# EAGLE design riffleito-KAP-REVB (EAGLE 6.5.0)
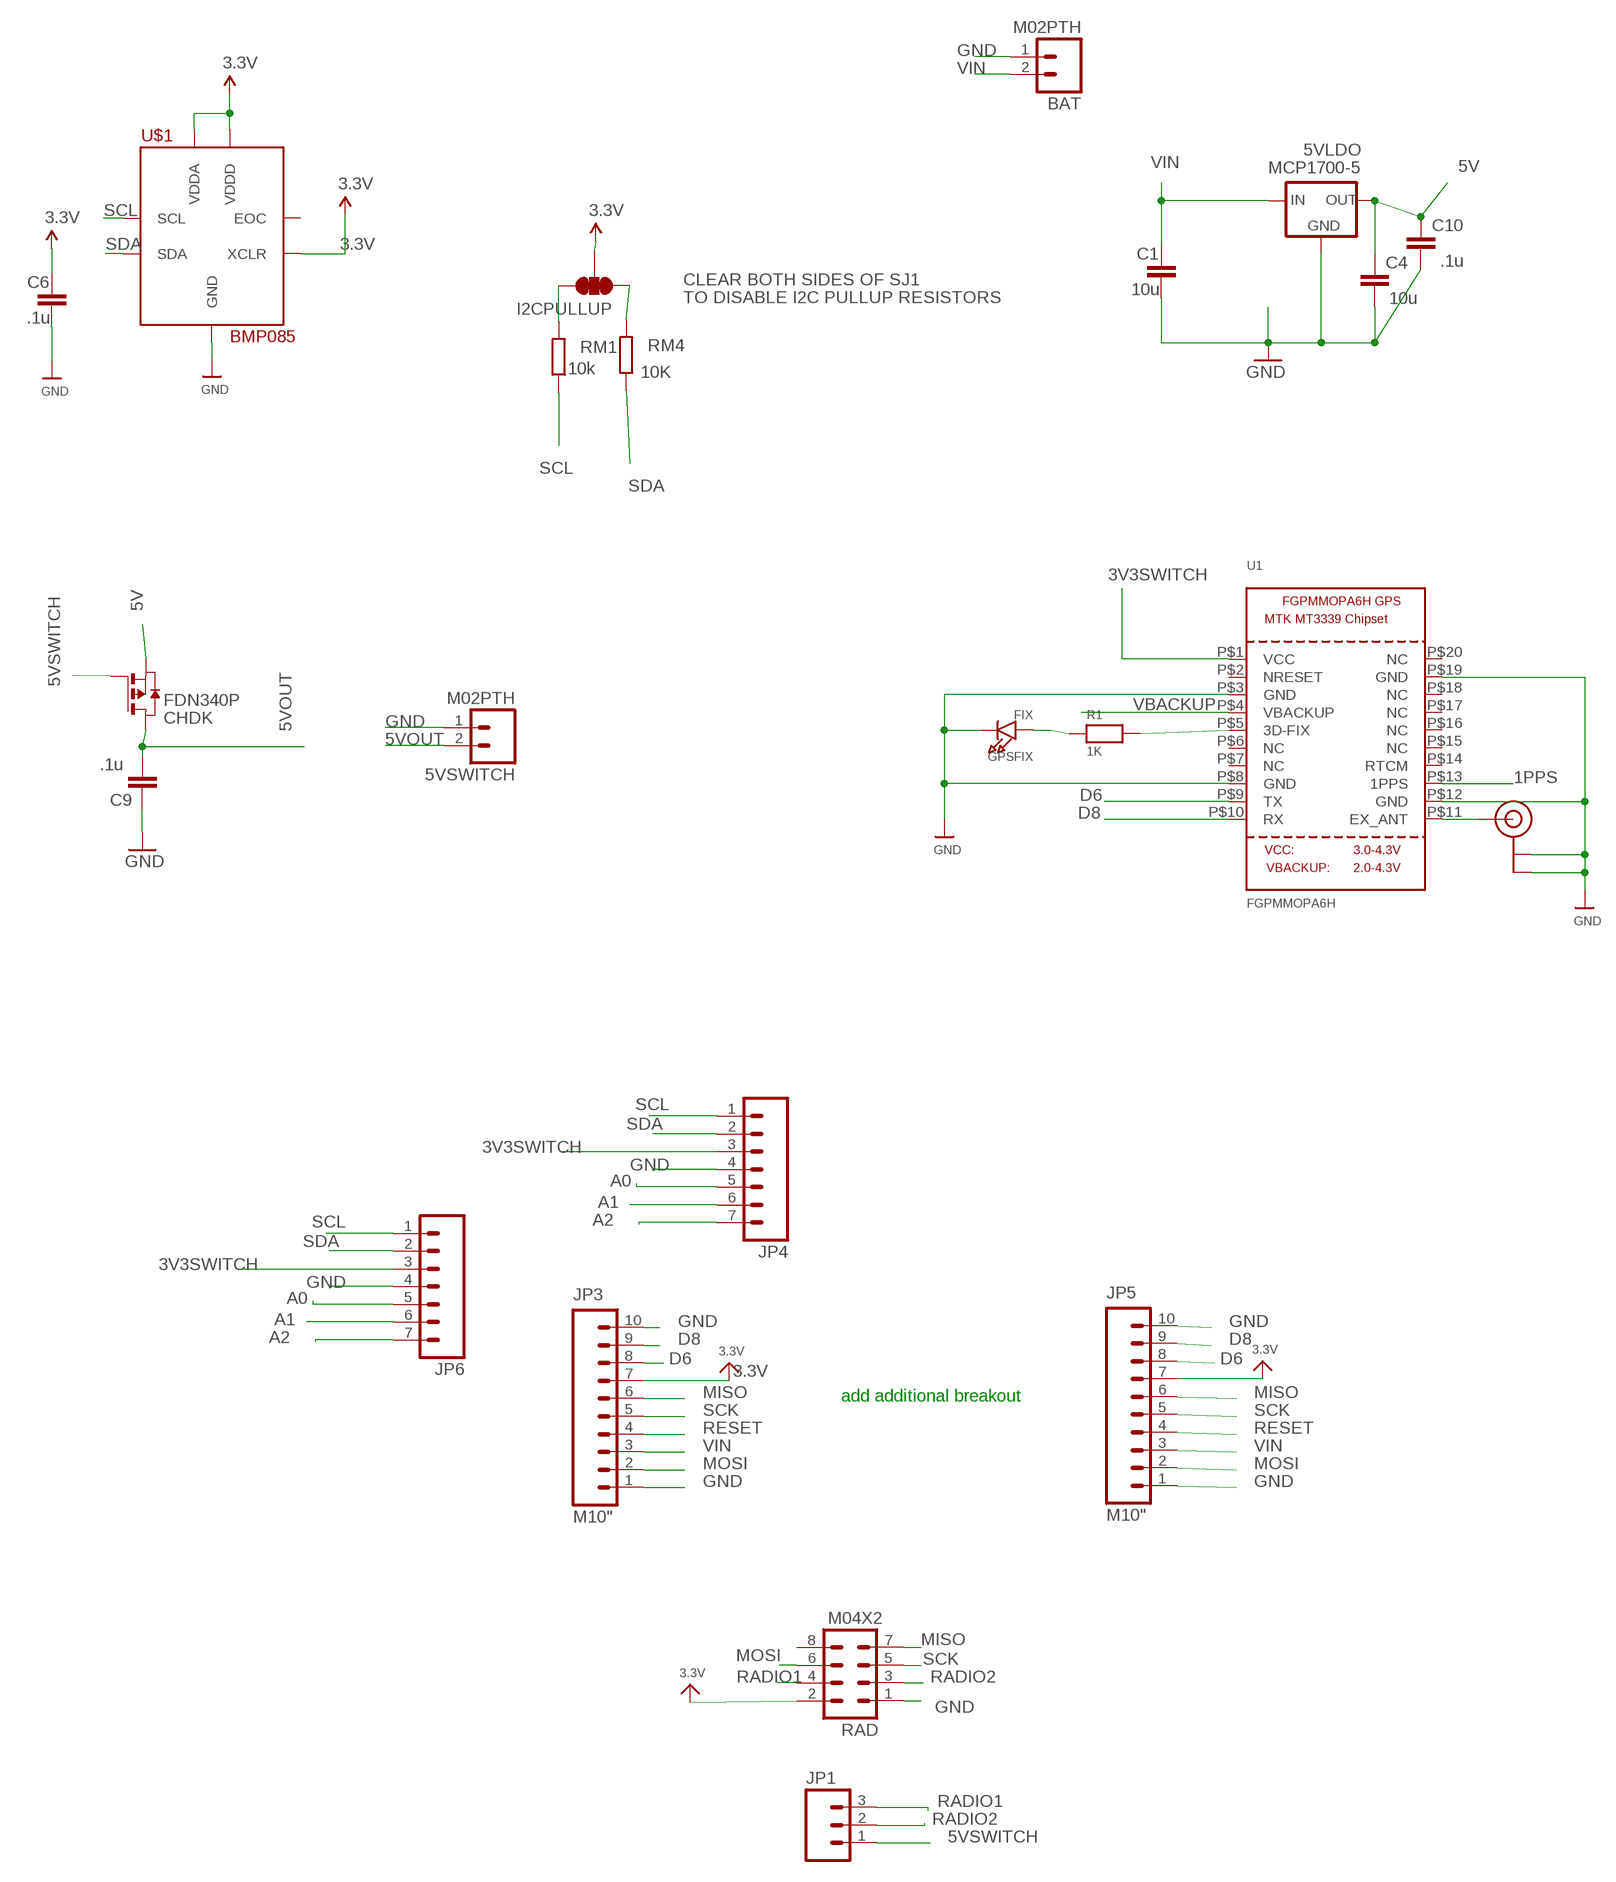
[diagram p0: schematic, sheet 1]

## Parts
5VLDO  MCP1700-5  MCP1700SOT233  [SOT23]
5VSWITCH  M02PTH  [1X02]
BAT  M02PTH  [1X02]
C1  10u  C-EUC0805  [C0805]
C4  10u  C-EUC0805  [C0805]
C6  .1u  C-EUC0805  [C0805]
C9  .1u  C-EUC0805  [C0805]
C10  .1u  C-EUC0805  [C0805]
CHDK  FDN340P  PMOSSOT23  [SOT-23]
GPSFIX  FIX  LED0805  [CHIPLED_0805]
I2CPULLUP  SOLDERJUMPER_2WAYPASTE1&2&3  [SJ_3_PASTE1&2&3]
JP1  M03PTH  [1X03]
JP3  M10"  [1X10]
JP4  M07  [1X07]
JP5  M10"  [1X10]
JP6  M07  [1X07]
R1  1K  RESISTOR0805  [0805]
RAD  M04X2  [2X4]
RM1  10k  R-EU_R0805  [R0805]
RM4  10K  R-EU_R0805  [R0805]
U1  FGPMMOPA6H  GPS_FGPMMOPA6H  [FGPMMOPA6H]
U$1  BMP085  [BMP085]
U$20  U.FL  [U.FL]

## Nets
1PPS: U1.P$13(1PPS)
3.3V: C6.1 I2CPULLUP.2 JP3.7 JP5.7 RAD.2 U$1.P$3(VDDA) U$1.P$4(VDDD) U$1.P$8(XCLR)
3V3SWITCH: JP4.3 JP6.3 U1.P$1(VCC)
5V: 5VLDO.2(OUT) C4.1 C10.1 CHDK.2(S)
5VOUT: 5VSWITCH.2 C9.2 CHDK.1(D)
5VSWITCH: CHDK.3(G) JP1.1
A0: JP4.5 JP6.5
A1: JP4.6 JP6.6
A2: JP4.7 JP6.7
D6: JP3.8 JP5.8 U1.P$9(TX)
D8: JP3.9 JP5.9 U1.P$10(RX)
GND: 5VLDO.1(GND) 5VSWITCH.1 BAT.1 C1.2 C4.2 C6.2 C9.1 C10.2 GPSFIX.C JP3.1 JP3.10 JP4.4 JP5.1 JP5.10 JP6.4 RAD.1 U1.P$3(GND) U1.P$8(GND) U1.P$12(GND) U1.P$19(GND) U$1.P$1(GND) U$20.P$1(GND) U$20.P$2(GND)
MISO: JP3.6 JP5.6 RAD.7
MOSI: JP3.2 JP5.2 RAD.6
N$1: GPSFIX.A R1.1
N$2: R1.2 U1.P$5(3D-FIX)
N$3: I2CPULLUP.3 RM1.2
N$4: U1.P$11(EX_ANT) U$20.P$3(SIGNAL)
N$9: I2CPULLUP.1 RM4.2
RADIO1: JP1.3 RAD.4
RADIO2: JP1.2 RAD.3
RESET: JP3.4 JP5.4
SCK: JP3.5 JP5.5 RAD.5
SCL: JP4.1 JP6.1 RM1.1 U$1.P$6(SCL)
SDA: JP4.2 JP6.2 RM4.1 U$1.P$7(SDA)
VBACKUP: U1.P$4(VBACKUP)
VIN [power]: 5VLDO.3(IN) BAT.2 C1.1 JP3.3 JP5.3
Unconnected: RAD.8 U1.P$2(NRESET) U1.P$6(NC) U1.P$7(NC) U1.P$14(RTCM) U1.P$15(NC) U1.P$16(NC) U1.P$17(NC) U1.P$18(NC) U1.P$20(NC) U$1.P$2(EOC)

## Notes on the sheet
- CLEAR BOTH SIDES OF SJ1
- TO DISABLE I2C PULLUP RESISTORS
- add additional breakout

## Library data of the parts
5VLDO = adafruit:MCP1700: VOLTAGE REGULATOR
5VSWITCH BAT = SparkFun-Connectors:M02: Standard 2-pin 0.1" header. Use with - straight break away headers ( PRT-00116) - right angle break away headers (PRT-00553) - swiss pins (PRT-00743) - machine pins (PRT-00117) - female headers (PRT-00115) Molex polarized connector foot print use with: PRT-08233 with associated crimp pins and housings. 2.54_SCREWTERM for use with PRT-10571. 3.5mm Screw Terminal footprints for PRT-08084 5mm Screw Terminal footprints for use with PRT-08433
C1 C4 C6 C9 C10 = resistor:C-EU: CAPACITOR, European symbol
CHDK = zetex:PMOSSOT23: MOS FET
GPSFIX = microbuilder:LED: LED 0603 - 0603 Surface Mount Package 2mA: Green LED - Low Power (3.9mcd, 2ma, 1.7Vf) - Digikey: 475-2709-2-ND Orange LED - Low Power (9.8mcd, 2ma, 1.8Vf) - Digikey: 475-1194-2-ND Red LED - Low Power (5mcd, 2ma, 1.8Vf) - Digikey: 475-1195-2-ND Yellow LED - Low Power (7mcd, 2ma, 1.8Vf) - Digikey: 475-1196-2-ND 5mA: Blue LED - Low Power (17mcd, 5ma, 2.9Vf) - Digikey: LNJ937W8CRACT-ND 0805 - 0805 Surface Mount Package 2mA: Red LED (8.8mcd, 2mA, 1.8Vf, Clear) - Low Power [Digikey: 475-2510-1-ND] Green LED (5mcd, 2mA, 1.8Vf, Clear) - Low Power [Digikey: 475-2730-1-ND] Yellow LED (11.3mcd, 2mA, 1.8Vf, Clear) - Low Power [Digikey: 475-2555-1-ND] 20mA: Red LED (104mcd, 20mA, Diffused) - LS R976 [Digikey: 475-1278-6-ND] Red LED (12mcd, 20mA, 2.0Vf, Clear) - APT2012EC [Digikey: 754-1128-1-ND] Green LED (15mcd, 20mA, 2.2Vf, Clear) - APT2012GC [Digikey: 754-1131-1-ND] Orange LED (160mcd, 20mA, 2.1Vf, Clear) - APT2012SECK [Digikey: 754-1130-1-ND] 1206 - 1206 Surface Mount Package Green LED (26mcd, 20mA, Diffused) - LG N971 [Digikey: 475-1407-6-ND] Red LED (15mcd, 20mA, Diffused) - LH N974 [Digikey: 475-1416-6-ND]
I2CPULLUP = mike-temp:SOLDERJUMPER_2WAY: Solder Jumper 2 way solder jumper
JP1 = SparkFun-Connectors:M03: Header 3 Standard 3-pin 0.1" header. Use with straight break away headers (SKU : PRT-00116), right angle break away headers (PRT-00553), swiss pins (PRT-00743), machine pins (PRT-00117), and female headers (PRT-00115). Molex polarized connector foot print use with SKU : PRT-08232 with associated crimp pins and housings.
JP3 JP5 = SparkFun-Connectors:M10: Header 10 Standard 10-pin 0.1" header. Use with straight break away headers (SKU : PRT-00116), right angle break away headers (PRT-00553), swiss pins (PRT-00743), machine pins (PRT-00117), and female headers (PRT-00115).
JP4 JP6 = SparkFun-Connectors:M07: Header 7 Standard 7-pin 0.1" header. Use with straight break away headers (SKU : PRT-00116), right angle break away headers (PRT-00553), swiss pins (PRT-00743), machine pins (PRT-00117), and female headers (PRT-00115). NOTES ON THE VARIANTS LOCK and LOCK_LONGPADS... This footprint was designed to help hold the alignment of a through-hole component (i.e. 7-pin header) while soldering it into place. You may notice that each hole has been shifted either up or down by 0.005 of an inch from it's more standard position (which is usually a perfectly straight line). This slight alteration caused the pins (the squares in the middle) to touch the edges of the holes. Because they are alternating, it causes a "brace" to hold the header in place. 0.005 has proven to be the perfect amount of "off-center" position when using our standard breakaway headers. Although looks a little odd when you look at the bare footprint, once you have a header in there, the alteration is very hard to notice. Also, if you push a header all the way into place, it is covered up entirely on the bottom side. This idea of altering the position of holes to aid alignment will be further integrated into the Sparkfun Library for other footprints. It can help hold any component with 3 or more connection pins.
R1 = microbuilder:RESISTOR: Resistors 0402 - 0402 Surface Mount Package 22 Ohm 1% 1/16W [Digikey: 311-22.0LRTR-ND] 33 Ohm 5% 1/16W 1.0K 5% 1/16W 1.5K 5% 1/16W 2.0K 1% 1/16W 10.0K 1% 1/16W [Digikey: 311-10.0KLRTR-ND] 10.0K 5% 1/16W [Digikey: RMCF0402JT10K0TR-ND] 12.1K 1% 1/16W [Digikey: 311-22.0LRTR-ND] 100.0K 5% 1/16W 0603 - 0603 Surface Mount Package 0 Ohm 1/10 Watt 1% Resistor 15 Ohm 1/10 Watt 1% Resistor 33 Ohm 1/10 Watt 1% Resistor 49.9 Ohm 1/10 Watt 1% Resistor 100 Ohm 1/10 Watt 1% Resistor 150 Ohm 1/10 Watt 1% Resistor 240 Ohm 1/10 Watt 1% Resistor 390 Ohm 1/10 Watt 1% Resistor 560 Ohm 1/10 Watt 1% Resistor 680 Ohm 1/10 Watt 1% Resistor 750 Ohm 1/10 Watt 1% Resistor 1.0K Ohm 1/10 Watt 1% Resistor 1.5K Ohm 1/10 Watt 1% Resistor 2.0K Ohm 1/10 Watt 1% Resistor 2.2K Ohm 1/10 Watt 1% Resistor 3.3K Ohm 1/10 Watt 1% Resistor 4.7K Ohm 1/10 Watt 1% Resistor 10.0K Ohm 1/10 Watt 1% Resistor 12.0K Ohm 1/10 Watt 1% Resistor 12.1K Ohm 1/10 Watt 1% Resistor 20.0K Ohm 1/10 Watt 1% Resistor 33.0K Ohm 1/10 Watt 1% Resistor 100.0K Ohm 1/10 Watt 1% Resistor 0805 - 0805 Surface Mount Package 0 Ohm 1/8 Watt 1% Resistor 33 Ohm 1/8 Watt 1% Resistor 100 Ohm 1/8 Watt 1% Resistor 150 Ohm 1/8 Watt 1% Resistor 200 Ohm 1/8 Watt 1% Resistor 240 Ohm 1/8 Watt 1% Resistor 330 Ohm 1/8 Watt 1% Resistor 390 Ohm 1/8 Watt 1% Resistor 470 Ohm 1/8 Watt 1% Resistor 1.0K Ohm 1/8 Watt 1% Resistor 1.5K Ohm 1/8 Watt 1% Resistor 2.0K Ohm 1/8 Watt 1% Resistor 4.7K Ohm 1/8 Watt 1% Resistor 5.1K Ohm 1/8 Watt 1% Resistor 5.6K Ohm 1/8 Watt 1% Resistor 10.0K Ohm 1/8 Watt 1% Resistor 22.0K Ohm 1/8 Watt 1% Resistor 33.0K Ohm 1/8 Watt 1% Resistor 100K Ohm 1/8 Watt 1% Resistor 1206 - 1206 Surface Mount Package 2012 - 2010 Surface Mount Package 0.11 Ohm 1/2 Watt 1% Resistor - Digikey: RHM.11UCT-ND
RAD = SparkFun-Connectors:M04X2: .1" header, two rows of four.
RM1 RM4 = rcl:R-EU_: RESISTOR, European symbol
U1 = microbuilder:GPS_FGPMMOPA6H: GPS Module - MTK MT3339 Chipset, -165dBm sensitivity, 22 channels, 10Hz, auto-select external antenna options
U$1 = JeeLabs:BMP085: BMP086 Bosch Digital Pressure Sensor
U$20 = microbuilder:U.FL: U.FL Antenna Connector

## Net classes
0 default: width 0.203 mm, drill 0.33 mm, clearance 0.203 mm
1 power: width 0.381 mm, drill 0.33 mm, clearance 0.254 mm

## Board
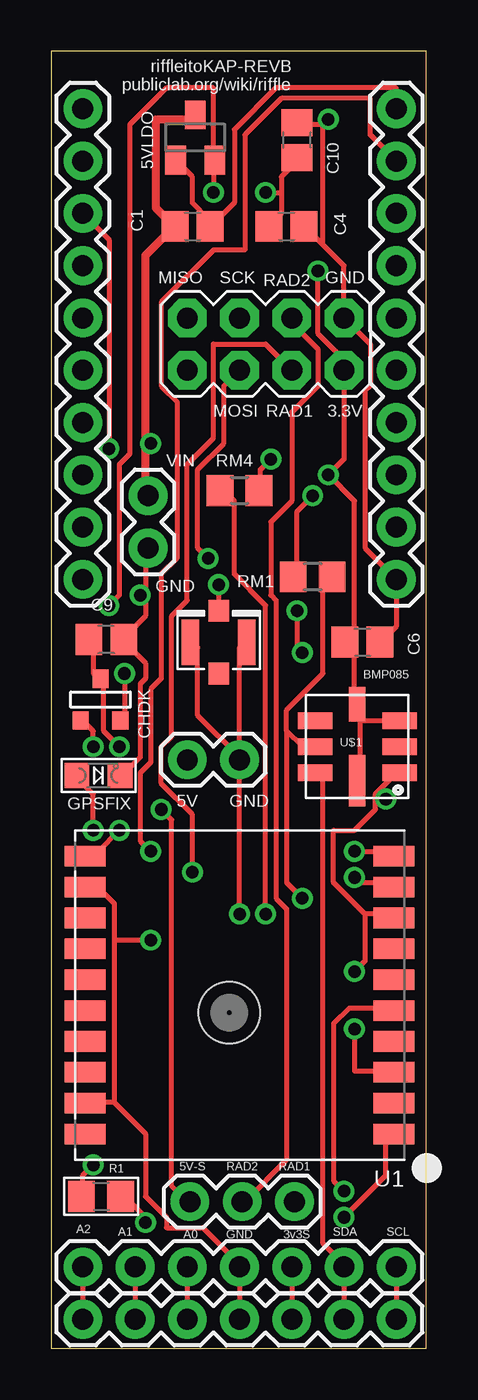
[diagram p1: board, top side]
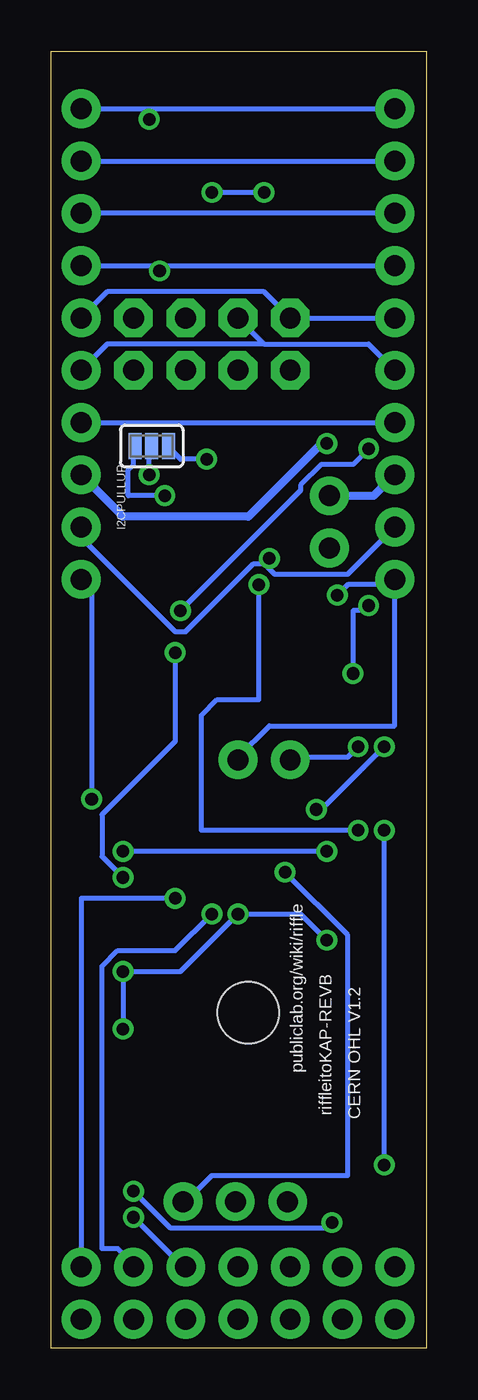
[diagram p2: board, bottom side, seen from below]

Size 18.21 x 62.98 mm. Coordinates in mm from the lower left corner, seen from the top.
Outline: 0,0 18.21,0 18.21,62.98 0,62.98 0,0
Copper layers (1*16): Top 0.035mm / dielectric 1.5mm / Bottom 0.035mm
Design rules "default": minimum track width 10mil, minimum drill 24mil, track to track 8mil, track to pad 8mil, pad to pad 8mil, via to via 8mil, smd to smd 8mil, copper to edge 40mil, drill to drill 8mil, minimum pad ring 10mil, minimum via ring 8mil, stop-mask expansion 4mil, vias tented up to drill 0mil, thermal gap 10mil

### Footprints (pad centres in the part's own frame; a part is rotated, then mirrored left to right if it is on the bottom)
SOT23 = smd 1 x 1.4: 1 -0.95,-1.1; 2 0.95,-1.1; 3 0,1.1
1X02 = drill 1.016 pad 1.88: 1 0,0; 2 2.54,0
C0805 = smd 1.3 x 1.5: 1 -0.85,0; 2 0.85,0
SOT-23 = smd 0.787 x 0.889: 1 0.025,-1.016; 2 -0.94,1.016; 3 0.991,1.016
CHIPLED_0805 = smd 1.2 x 1.2: A 0,-1.05; C 0,1.05
SJ_3_PASTE1&2&3 = smd 0.635 x 1.27: 1 -0.813,0; 2 0,0; 3 0.813,0
1X03 = drill 1.016 pad 1.88: 1 0,0; 2 2.54,0; 3 5.08,0
1X10 = drill 1.016 pad 1.88: 1 0,0; 2 2.54,0; 3 5.08,0; 4 7.62,0; 5 10.16,0; 6 12.7,0; 7 15.24,0; 8 17.78,0; 9 20.32,0; 10 22.86,0
1X07 = drill 1.016 pad 1.88: 1 0,0; 2 2.54,0; 3 5.08,0; 4 7.62,0; 5 10.16,0; 6 12.7,0; 7 15.24,0
0805 = smd 1.3 x 1.5: 1 -0.95,0; 2 0.95,0
2X4 = drill 1.016 pad 1.88 octagon: 1 -3.81,-1.27; 2 -3.81,1.27; 3 -1.27,-1.27; 4 -1.27,1.27; 5 1.27,-1.27; 6 1.27,1.27; 7 3.81,-1.27; 8 3.81,1.27
R0805 = smd 1.3 x 1.5: 1 -0.95,0; 2 0.95,0
FGPMMOPA6H = smd 2 x 1: P$1 -7.5,6.75; P$2 -7.5,5.25; P$3 -7.5,3.75; P$4 -7.5,2.25; P$5 -7.5,0.75; P$6 -7.5,-0.75; P$7 -7.5,-2.25; P$8 -7.5,-3.75; P$9 -7.5,-5.25; P$10 -7.5,-6.75; P$11 7.5,-6.75; P$12 7.5,-5.25; P$13 7.5,-3.75; P$14 7.5,-2.25; P$15 7.5,-0.75; P$16 7.5,0.75; P$17 7.5,2.25; P$18 7.5,3.75; P$19 7.5,5.25; P$20 7.5,6.75 | hole 3: 0.5,0.85
BMP085 = smd 1.68 x 0.8: P$1 -2.06,1.27; P$2 -2.06,0; P$3 -2.06,-1.27; P$5 2.04,-1.27; P$6 2.04,0; P$7 2.04,1.27 | smd 0.8 x 1.68: P$4 0,-2.06 | smd 0.8 x 2.5: P$8 0,1.65
U.FL = smd 2.2 x 0.85: P$1 0,1.375; P$2 0,-1.375 | smd 1.05 x 1: P$3 1.525,0; P$4 -1.525,0

### Placement (x,y rotation side)
5VLDO  6.99,58.8 0 top
5VSWITCH  9.14,28.57 180 top
BAT  4.7,38.86 90 top
C1  6.86,54.48 0 top
C4  11.43,54.48 0 top
C6  15.11,34.29 0 top
C9  2.67,34.42 180 top
C10  11.94,58.67 90 top
CHDK  2.41,31.5 180 top
GPSFIX  2.29,27.81 270 top
I2CPULLUP  13.34,43.81 180 bottom
JP1  6.73,7.11 0 top
JP3  16.76,37.34 90 top
JP4  16.76,3.94 180 top
JP5  1.52,37.34 90 top
JP6  16.76,1.4 180 top
R1  2.41,7.37 0 top
RAD  10.41,48.77 180 top
RM1  12.7,37.47 180 top
RM4  9.14,41.66 0 top
U1  9.14,17.14 180 top
U$1  14.86,29.21 180 top
U$20  8.13,34.29 90 top

### Tracks (layer width: path | path; a pad name or v marks a point on that pad's centre or on a via)
3.3V  (via drill 0.61)
  Top 0.254: 14.73,34.04 14.48,34.29 C6.1 14.73,34.04 | 14.73,34.04 14.73,31.5 U$1.P$4 | 14.99,30.48 U$1.P$3 | 14.99,30.48 14.99,31.24 U$1.P$4 | 14.99,30.48 14.99,27.69 U$1.P$8 | 14.99,30.48 U$1.P$4 | 14.73,34.04 14.73,41.15 v13.46,42.42 14.22,43.18 RAD.2 14.22,48.01 12.95,49.28 v12.95,52.32
  Bottom 0.254: JP3.7 12.95,52.58 | 12.95,52.58 JP5.7 | v13.46,42.42 13.46,43.69 I2CPULLUP.2 | v12.95,52.32 12.95,52.58
3V3SWITCH  (via drill 0.61)
  Top 0.254: v14.22,6.35 16.26,8.38 16.26,9.91 16.51,10.16 U1.P$1 | JP4.3 JP6.3
  Bottom 0.254: v14.22,6.35 11.94,4.06 11.68,4.06 JP4.3
5V  (via drill 0.61)
  Top 0.254: 11.18,56.13 11.18,56.9 11.94,57.66 C10.1 | 11.18,56.13 11.18,55.12 10.67,54.61 C4.1 | v3.56,32.77 3.56,30.48 CHDK.2 | v2.79,36.07 3.3,36.58 3.3,42.93 3.81,43.43 3.81,59.44 5.59,61.21 7.87,61.21 7.87,57.91 5VLDO.2 7.87,57.66 v7.87,56.13 | v10.41,56.13 11.18,56.13
  Bottom 0.254: v3.56,32.77 3.56,35.81 3.05,35.81 v2.79,36.07 | v7.87,56.13 v10.41,56.13
5VOUT  (via drill 0.61)
  Top 0.254: C9.2 2.03,34.29 2.03,32.77 2.29,32.51 CHDK.1 2.54,32.51 2.54,29.97 v3.3,29.21
  Bottom 0.254: v3.3,29.21 3.81,28.7 6.6,28.7 5VSWITCH.2
5VSWITCH  (via drill 0.61)
  Top 0.254: v2.03,29.21 2.03,29.97 1.52,30.48 CHDK.3 | v5.33,26.16 5.84,25.65 5.84,7.87 6.6,7.11 JP1.1
  Bottom 0.254: v2.03,29.21 5.08,26.16 v5.33,26.16
A0
  Top 0.254: JP4.5 JP6.5
A1
  Top 0.254: JP4.6 JP6.6
A2
  Top 0.254: JP4.7 JP6.7
D6  (via drill 0.61)
  Top 0.254: v14.73,22.86 14.73,22.61 16.51,22.61 U1.P$9 | v12.19,33.78 11.94,34.04 v11.94,35.81 | v2.79,43.69 2.79,53.85 JP5.8
  Bottom 0.254: v14.73,22.86 15.75,23.88 15.75,25.91 12.19,29.46 v12.19,33.78 | v11.94,35.81 6.1,41.66 6.1,41.91 5.08,42.93 3.56,42.93 v2.79,43.69 | JP5.8 JP3.8
D8  (via drill 0.61)
  Top 0.254: v14.73,24.13 16.51,24.13 U1.P$10 | v4.83,24.13 4.32,24.64 4.32,27.94 4.83,28.45 4.83,32 5.33,32.51 5.33,37.59 6.1,38.35 6.1,45.97 5.33,46.74 5.33,50.8 7.87,53.34 9.4,53.34 9.4,58.93 11.18,60.71 15.49,60.71 15.49,58.93 JP3.9
  Bottom 0.254: v4.83,24.13 v14.73,24.13 | JP3.9 JP5.9
GND  (via drill 0.61)
  Top 0.254: JP6.4 JP4.4 9.14,4.06 7.37,5.84 5.59,5.84 5.59,6.35 4.57,7.37 4.57,10.41 3.05,11.94 | 3.05,11.94 1.78,11.94 U1.P$19 | 3.05,19.81 3.05,21.59 2.29,22.35 1.78,22.35 U1.P$12 | 3.05,19.81 3.05,11.94 | 5VLDO.1 6.1,57.66 6.86,56.9 6.86,55.63 7.62,54.86 7.62,54.61 C1.2 7.87,54.61 8.89,55.63 8.89,59.18 10.92,61.21 16.76,61.21 JP3.10 | GPSFIX.C 3.56,27.94 4.32,28.7 4.32,32.26 4.57,32.51 4.57,33.27 3.56,34.29 C9.1 3.56,34.54 4.57,35.56 4.57,36.58 | 4.57,36.58 4.57,38.86 BAT.1 | 9.14,28.7 7.11,30.73 7.11,34.04 6.86,34.29 U$20.P$1 | 9.14,28.7 9.14,34.04 9.4,34.29 U$20.P$2 | 9.14,28.7 5VSWITCH.1 v9.14,21.08 | v4.32,36.58 4.57,36.58 | 15.75,26.67 15.75,26.16 14.73,25.15 13.72,25.15 13.72,22.61 15.24,21.08 | 15.75,26.67 15.75,26.92 16.76,27.94 U$1.P$1 | 15.24,21.08 16.51,21.08 U1.P$8 | v14.73,15.49 14.73,13.46 16.51,13.46 U1.P$3 | v14.73,18.29 15.24,18.8 15.24,21.08 | C6.2 16,34.29 16.76,35.05 JP3.1 15.24,38.86 15.24,46.48 15.49,46.74 15.49,48.77 RAD.1 14.22,52.58 13.21,53.59 | 13.21,53.59 12.45,54.36 C4.2 | 13.21,59.44 11.94,59.44 C10.2 | 13.21,53.59 13.21,59.44 | v16.26,26.67 15.75,26.67 | 13.21,59.44 v13.46,59.69 | v4.83,19.81 3.05,19.81
  Bottom 0.254: JP3.10 13.46,60.2 | 13.46,60.2 JP5.10 | 1.52,37.08 1.52,30.23 7.62,30.23 9.14,28.7 5VSWITCH.1 | v4.32,36.58 3.81,37.08 1.52,37.08 | 1.52,37.08 JP5.1 | v14.73,15.49 v14.73,18.29 11.94,18.29 v9.14,21.08 6.1,21.08 v4.83,19.81 | v16.26,26.67 16.26,37.34 JP3.1 | v13.46,59.69 13.46,60.2
MISO
  Bottom 0.254: JP5.6 RAD.7 7.87,51.31 15.49,51.31 JP3.6
MOSI  (via drill 0.61)
  Top 0.254: RAD.6 8.38,46.74 8.38,43.94 7.11,42.67 7.11,38.86 v7.62,38.35
  Bottom 0.254: JP5.2 3.81,37.59 7.37,37.59 7.87,38.1 | 7.87,38.1 8.38,38.1 11.68,34.8 12.19,34.8 16.76,39.37 JP3.2 | 7.87,38.1 v7.62,38.35
N$1  (via drill 0.61)
  Top 0.254: v2.03,25.15 2.03,26.92 1.27,27.69 GPSFIX.A | v2.03,8.89 1.52,8.38 1.52,7.37 R1.1
  Bottom 0.254: v2.03,8.89 v2.03,25.15
N$2  (via drill 0.61)
  Top 0.254: v4.57,6.1 4.57,6.35 3.56,7.37 R1.2 | v14.22,7.62 13.72,8.13 13.72,15.75 14.48,16.51 16.51,16.51 U1.P$5
  Bottom 0.254: v4.57,6.1 4.83,5.84 12.45,5.84 v14.22,7.62
N$3  (via drill 0.61)
  Top 0.254: v12.7,41.4 11.94,40.64 11.94,37.59 RM1.2
  Bottom 0.254: v12.7,41.4 14.48,41.4 14.48,42.67 14.22,42.93 14.22,43.69 I2CPULLUP.3
N$4  (via drill 0.61)
  Top 0.254: v8.13,37.08 U$20.P$3 | v3.3,25.15 2.29,24.13 1.78,24.13 U1.P$11
  Bottom 0.254: v8.13,37.08 8.13,31.5 10.16,31.5 10.92,30.73 10.92,25.15 v3.3,25.15
N$9  (via drill 0.61)
  Top 0.254: v10.67,43.18 10.16,42.67 10.16,41.66 RM4.2
  Bottom 0.254: v10.67,43.18 11.94,43.18 12.45,43.69 I2CPULLUP.1
RADIO1  (via drill 0.61)
  Top 0.254: RAD.4 10.41,48.77 7.87,48.77 7.87,44.2 6.6,42.93 6.6,36.32 5.84,35.56 5.84,29.72 5.33,29.21 5.33,27.43 6.86,25.91 v6.86,23.11
  Bottom 0.254: v6.86,23.11 3.81,20.07 3.81,8.38 10.41,8.38 11.68,7.11 JP1.3
RADIO2
  Top 0.254: RAD.3 11.68,49.78 12.95,48.51 12.95,46.74 11.68,45.47 11.68,41.15 10.67,40.13 10.67,36.58 10.92,36.32 10.92,21.84 11.43,21.34 11.43,9.14 9.4,7.11 JP1.2
RESET
  Bottom 0.254: JP3.4 JP5.4
SCK
  Bottom 0.254: JP5.5 2.79,48.77 7.87,48.77 | RAD.5 7.87,48.77 | JP3.5 15.49,48.77 7.87,48.77
SCL  (via drill 0.61)
  Top 0.254: JP4.1 JP6.1 | 11.43,29.97 11.43,30.99 13.21,32.77 13.21,37.08 13.46,37.34 RM1.1 | 11.43,29.97 12.19,29.21 U$1.P$6 | v12.19,21.84 11.43,22.61 11.43,29.97
  Bottom 0.254: JP4.1 16.76,21.84 v12.19,21.84
SDA  (via drill 0.61)
  Top 0.254: v10.41,21.08 10.41,36.07 8.89,37.59 8.89,41.15 8.38,41.66 RM4.1 | U$1.P$7 12.95,27.94 13.21,27.69 13.21,5.08 14.22,4.06 JP4.2 JP6.2
  Bottom 0.254: v10.41,21.08 12.19,19.3 14.99,19.3 15.75,18.54 15.75,4.83 14.99,4.83 14.22,4.06 JP4.2
VIN  (via drill 0.61)
  Top 0.381: 5VLDO.3 6.86,59.69 5.08,59.69 5.08,55.37 5.84,54.61 C1.1 5.84,54.36 4.57,53.09 4.57,43.94 | 4.57,43.94 4.57,41.4 BAT.2 | 4.57,43.94 v4.83,43.94
  Bottom 0.381: JP5.3 2.54,41.4 BAT.2 | JP3.3 14.73,40.39 8.64,40.39 5.08,43.94 v4.83,43.94

### Text on the board
tPlace: riffleitoKAP-REVB | publiclab.org/wiki/riffle | MISO | SCK | RAD2 | GND | MOSI | RAD1 | 3.3V | VIN | GND | 5V | GND | 5V-S | RAD2 | RAD1 | A2 | A1 | A0 | GND | 3v3S | SDA | SCL
bPlace: publiclab.org/wiki/riffle | CERN OHL V1.2 | riffleitoKAP-REVB